# Altium schematic sheet PowerSwitch_DiodeOr.SchDoc
size A
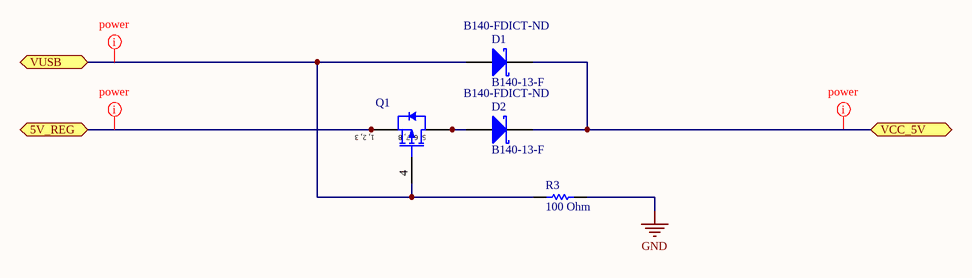
[diagram p0: PowerSwitch_DiodeOr.SchDoc]

## Parts
D1  B140-13-F  Supplier Part Number 1: B140-FDICT-ND  [DIOD-B1X0-2_V]
D2  B140-13-F  Supplier Part Number 1: B140-FDICT-ND  [DIOD-B1X0-2_V]
Q1  SiSS23DN-T1-GE3  [VISH-PPAK1212-8S_V]  (value not drawn)
R3  value 100 Ohm  [RESC0402(1005)_N]  (hidden comment: 2K 5% 0402(1005))

## Ports
5V_REG, VCC_5V, VUSB

## Nets
GND: R3.2
5V_REG: Q1.1(S) Q1.2(S) Q1.3(S) ; port 5V_REG
VCC_5V: D1.1(K) D2.1(K) ; port VCC_5V
VUSB: D1.2(A) Q1.4(G) R3.1 ; port VUSB
NetD2_2: D2.2(A) Q1.5(D) Q1.6(D) Q1.7(D) Q1.8(D)

## Layout directives
net class power: 5V_REG, VCC_5V, VUSB

## Notes on the sheet
- (in symbol CMP-1709-00001-3) 1, 2, 3; 5, 6, 7, 8

## Library data of the parts
D1 D2 = CMP-2000-05096-1: Surface Mount Schottky Barrier Rectifier, 1 A, -65 to 150 degC, 2-Pin SMA, RoHS, Tape and Reel; Manufacturer: DiodesIncorporated; HOUSEPART: YES; MPN: MF-DIO-SMA-B140; Vrrm - Repetitive Reverse Voltage: 40V; Unit Weight: 0.002258oz; Ir - Reverse Current: 500uA; If - Forward Current: 1A; Ifsm - Forward Surge Current: 30A; Configuration: Single; Vf - Forward Voltage: 0.5V; Technology: Si; Mounting Style: SMD/SMT; Package Description: 2-Pin Surface Mount Device, Body 4.3 x 2.605 mm; Datasheet Version: Rev. 18-2, 05/2013; Product: SchottkyDiodes; Height: 2.1mm; RoHS: True; Maximum Operating Temperature: +150C; Manufacturer URL: http://www.diodes.com/; Datasheet URL: http://www.diodes.com/_files/datasheets/ds13002.pdf; Minimum Operating Temperature: -65C; Package / Case: SMA; Termination Style: SMD/SMT; Length: 4.6mm; Operating Temperature Range: -65Cto+150C; Package Reference: SMA; Product Category: SchottkyDiodes&Rectifiers; Factory Pack Quantity: 5000; Series: B140; Width: 2.92mm; Brand: DiodesIncorporated; Type: SchottkyBarrierRectifier; Packaging: Reel; Supplier 1: Digi-Key
Q1 = CMP-1709-00001-3: P-Channel MOSFET, 20 V, -50 to 150 degC, 8-Pin SMD (PPAK1212-8S), RoHS, Tape and Reel; ComponentLink3URL: http://www.vishay.com/docs/63919/caseoutl.pdf; ComponentLink1URL: http://www.vishay.com/; ComponentLink3Description: Package Specification; PackageVersion: Rev. A, 03/2012; PartNumber: SiSS23DN-T1-GE3; DatasheetVersion: Rev. A; ComponentLink1Description: Manufacturer URL; Mounting Technology: Surface Mount; ComponentLink2Description: Datasheet; PackageDescription: 8-Pin Surface Mount Device, Body 3.3 x 3.3 mm, Pitch 0.66 mm; ComponentLink2URL: http://www.vishay.com/docs/62852/siss23dn.pdf; Supplier 1: Digi-Key; Supplier Part Number 1: SISS23DN-T1-GE3CT-ND
R3 = CMP-1011-00081-1: 100 0.063W 5% 0402 (1005 Metric)  SMD; MPN: MF-RES-0402-10K; HOUSEPART: YES; Case-EIA: 0402; Case-Metric: 1005; Technology: SMT; Tolerance: 5 %; Supplier 1: Digi-Key; Supplier Part Number 1: P19853TR-ND